# EAGLE design PDT3535LEDbackup (EAGLE 9.2.2)
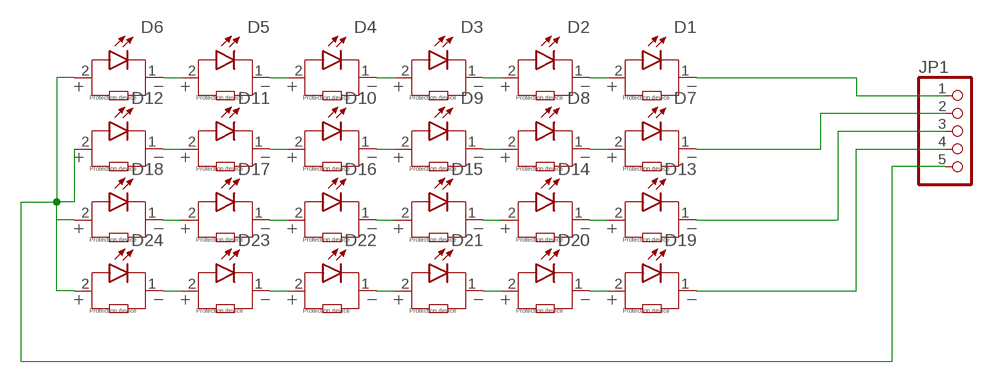
[diagram p0: schematic, sheet 1]

## Parts
D1  WL-SWTC_3535_158353060_6000K  [WL-SWTC_3535]
D2  WL-SWTC_3535_158353060_6000K  [WL-SWTC_3535]
D3  WL-SWTC_3535_158353060_6000K  [WL-SWTC_3535]
D4  WL-SWTC_3535_158353060_6000K  [WL-SWTC_3535]
D5  WL-SWTC_3535_158353060_6000K  [WL-SWTC_3535]
D6  WL-SWTC_3535_158353060_6000K  [WL-SWTC_3535]
D7  WL-SWTC_3535_158353060_6000K  [WL-SWTC_3535]
D8  WL-SWTC_3535_158353060_6000K  [WL-SWTC_3535]
D9  WL-SWTC_3535_158353060_6000K  [WL-SWTC_3535]
D10  WL-SWTC_3535_158353060_6000K  [WL-SWTC_3535]
D11  WL-SWTC_3535_158353060_6000K  [WL-SWTC_3535]
D12  WL-SWTC_3535_158353060_6000K  [WL-SWTC_3535]
D13  WL-SWTC_3535_158353060_6000K  [WL-SWTC_3535]
D14  WL-SWTC_3535_158353060_6000K  [WL-SWTC_3535]
D15  WL-SWTC_3535_158353060_6000K  [WL-SWTC_3535]
D16  WL-SWTC_3535_158353060_6000K  [WL-SWTC_3535]
D17  WL-SWTC_3535_158353060_6000K  [WL-SWTC_3535]
D18  WL-SWTC_3535_158353060_6000K  [WL-SWTC_3535]
D19  WL-SWTC_3535_158353060_6000K  [WL-SWTC_3535]
D20  WL-SWTC_3535_158353060_6000K  [WL-SWTC_3535]
D21  WL-SWTC_3535_158353060_6000K  [WL-SWTC_3535]
D22  WL-SWTC_3535_158353060_6000K  [WL-SWTC_3535]
D23  WL-SWTC_3535_158353060_6000K  [WL-SWTC_3535]
D24  WL-SWTC_3535_158353060_6000K  [WL-SWTC_3535]
JP1  PINHD-1X05_2.54-SMD-90°  [1X05SMD/90]

## Nets
N$1: D6.2 D12.2 D18.2 D24.2 JP1.5
N$6: D5.2 D6.1
N$7: D4.2 D5.1
N$8: D3.2 D4.1
N$9: D2.2 D3.1
N$10: D1.2 D2.1
N$11: D11.2 D12.1
N$12: D17.2 D18.1
N$13: D23.2 D24.1
N$14: D22.2 D23.1
N$15: D16.2 D17.1
N$16: D10.2 D11.1
N$17: D9.2 D10.1
N$18: D15.2 D16.1
N$19: D21.2 D22.1
N$20: D20.2 D21.1
N$21: D14.2 D15.1
N$22: D8.2 D9.1
N$23: D7.2 D8.1
N$24: D13.2 D14.1
N$25: D19.2 D20.1
N$26: D19.1 JP1.4
N$27: D13.1 JP1.3
N$28: D7.1 JP1.2
N$29: D1.1 JP1.1

## Library data of the parts
D1-D24 = Wurth_Elektronik_Optoelectronics_rev17b:WL-SWTC_3535: WL-SWTC SMD White Top view Ceramic LED Size 3535, waterclear dome lens Characteristics Fast switching No IR radiation High brightness Minimal side emission Waterclear silicone lens Top view Flexible coupling with secondary optic Various color temperatures Compact footprint Thermal resistance junction to solder point: 8 °K/W LED junction temperature: 150 °C Moisture Sensitivity Level: 2 Applications Indoor lighting: Spot light, Down light Outdoor lighting: Street light, Security light, Tunnel light, Parking lots light Industrial lighting: High-bay light, Low-bay light Consumer lighting: Torch light Agricultural equipment lighting Signal and symbol luminaries <http://katalog.we-online.de/media/images/eipal/WL-SWTC_pf2.jpg> Details see: http://katalog.we-online.de/en/led/WL-SWTC/158353060?m Created 2015-01-06, 2015 (C) Wurth Elektronik
JP1 = pinhead-2:PINHD-1X05: PIN HEADER

## Board
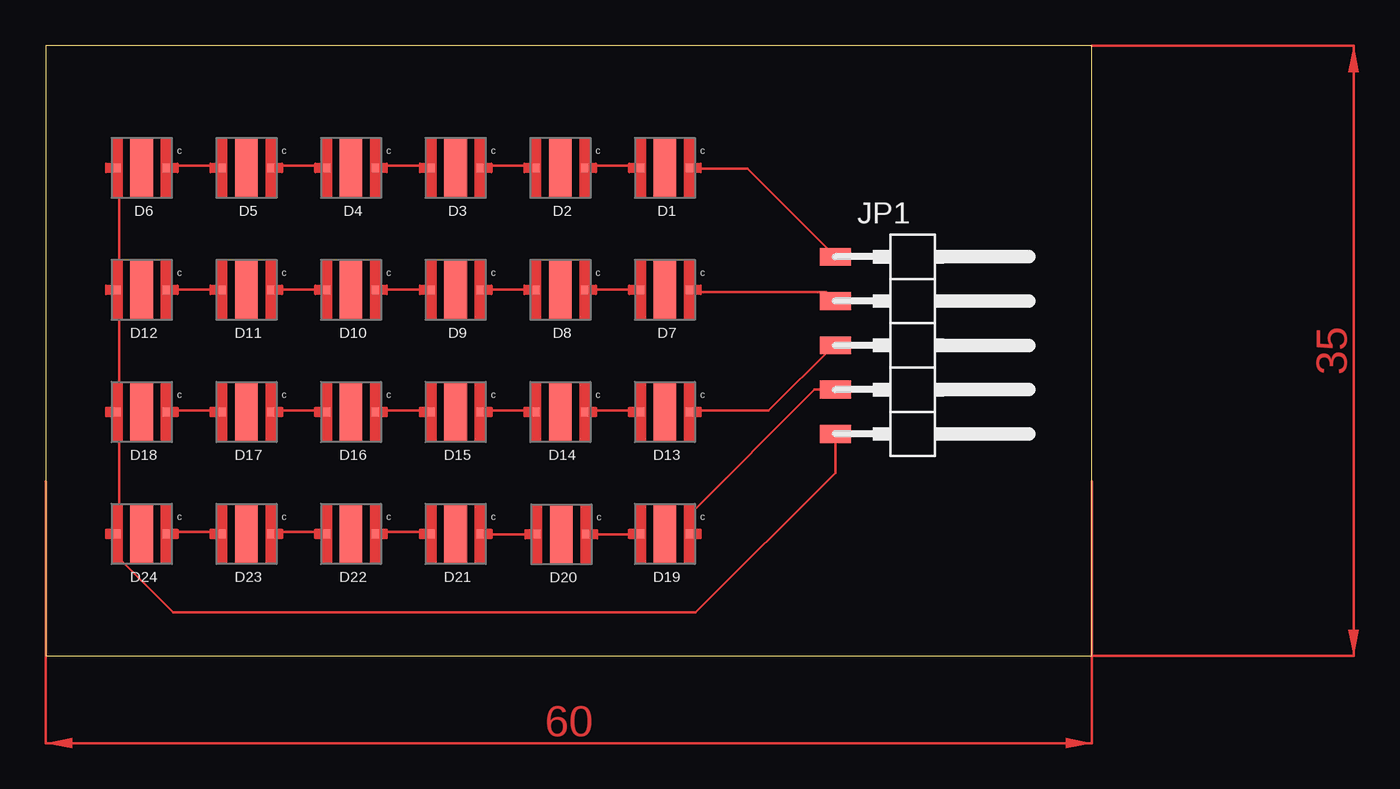
[diagram p1: board, top side]

Size 60 x 35 mm. Coordinates in mm from the lower left corner, seen from the top.
Outline: 0,0 60,0 60,35 0,35 0,0
Copper layers (1*16): Top 0.035mm / dielectric 1.5mm / Bottom 0.035mm
Design rules "default": minimum track width 6mil, minimum drill 0.35mm, track to track 6mil, track to pad 6mil, pad to pad 6mil, via to via 6mil, smd to smd 6mil, copper to edge 40mil, drill to drill 6mil, minimum pad ring 10mil, minimum via ring 8mil, stop-mask expansion 4mil, vias tented up to drill 0mil, thermal gap 10mil

### Footprints (pad centres in the part's own frame; a part is rotated, then mirrored left to right if it is on the bottom)
WL-SWTC_3535 = smd 0.4 x 0.5: 1 -1.4,0; 2 1.4,0 | smd 1.3 x 3.3: 3 0,0
1X05SMD/90 = smd 1.016 x 1.778: 1 -1.27,-5.08; 2 1.27,-5.08; 3 3.81,-5.08; 4 6.35,-5.08; 5 8.89,-5.08

### Placement (x,y rotation side)
D1  35.5,28 180 top
D2  29.5,28 180 top
D3  23.5,28 180 top
D4  17.5,28 180 top
D5  11.5,28 180 top
D6  5.5,28 180 top
D7  35.5,21 180 top
D8  29.5,21 180 top
D9  23.5,21 180 top
D10  17.5,21 180 top
D11  11.5,21 180 top
D12  5.5,21 180 top
D13  35.5,14 180 top
D14  29.5,14 180 top
D15  23.5,14 180 top
D16  17.5,14 180 top
D17  11.5,14 180 top
D18  5.5,14 180 top
D19  35.5,7 180 top
D20  29.56,6.98 180 top
D21  23.5,7 180 top
D22  17.5,7 180 top
D23  11.5,7 180 top
D24  5.5,7 180 top
JP1  50.35,21.63 270 top

### Tracks (layer width: path | path; a pad name or v marks a point on that pad's centre or on a via)
N$1
  Top 0.152: D6.2 4.2,27.96 4.2,21.02 D12.2 4.2,20.87 4.2,14.08 D18.2 4.2,13.92 4.2,7.13 D24.2 4.2,6.98 4.2,5.61 7.31,2.5 37.27,2.5 45.27,10.5 JP1.5
N$6
  Top 0.152: D6.1 6.94,28.11 9.99,28.11 D5.2
N$7
  Top 0.152: D5.1 13.03,28.11 16.08,28.11 D4.2
N$8
  Top 0.152: D4.1 18.98,28.11 22.03,28.11 D3.2
N$9
  Top 0.152: D3.1 24.92,28.11 27.97,28.11 D2.2
N$10
  Top 0.152: D2.1 31.02,28.11 34.07,28.11 D1.2
N$11
  Top 0.152: D12.1 6.94,21.02 9.99,21.02 D11.2
N$12
  Top 0.152: D18.1 6.94,14.08 9.99,14.08 D17.2
N$13
  Top 0.152: D24.1 6.94,7.13 9.99,7.13 D23.2
N$14
  Top 0.152: D23.1 13.03,7.13 16.08,7.13 D22.2
N$15
  Top 0.152: D17.1 13.03,14.08 16.08,14.08 D16.2
N$16
  Top 0.152: D11.1 13.03,21.02 16.08,21.02 D10.2
N$17
  Top 0.152: D10.1 18.98,21.02 22.03,21.02 D9.2
N$18
  Top 0.152: D16.1 18.98,14.08 22.03,14.08 D15.2
N$19
  Top 0.152: D22.1 18.98,7.13 22.03,7.13 D21.2
N$20
  Top 0.152: D20.2 28.12,6.98 24.92,6.98 D21.1
N$21
  Top 0.152: D15.1 24.92,14.08 27.97,14.08 D14.2
N$22
  Top 0.152: D9.1 24.92,21.02 27.97,21.02 D8.2
N$23
  Top 0.152: D8.1 31.02,21.02 34.07,21.02 D7.2
N$24
  Top 0.152: D14.1 31.02,14.08 34.07,14.08 D13.2
N$25
  Top 0.152: D20.1 31.02,6.98 34.07,6.98 D19.2
N$26
  Top 0.152: JP1.4 44.09,15.28 36.9,8.09 D19.1
N$27
  Top 0.152: D13.1 36.96,14.08 41.45,14.08 45.19,17.82 JP1.3
N$28
  Top 0.152: D7.1 36.96,20.87 44.73,20.87 45.19,20.41 JP1.2
N$29
  Top 0.152: D1.1 36.96,27.96 40.23,27.96 45.19,23 JP1.1
(copper drawn outside any net)
  shapes: Top area x2